# Altium project Golden_Arduino.PrjPcb
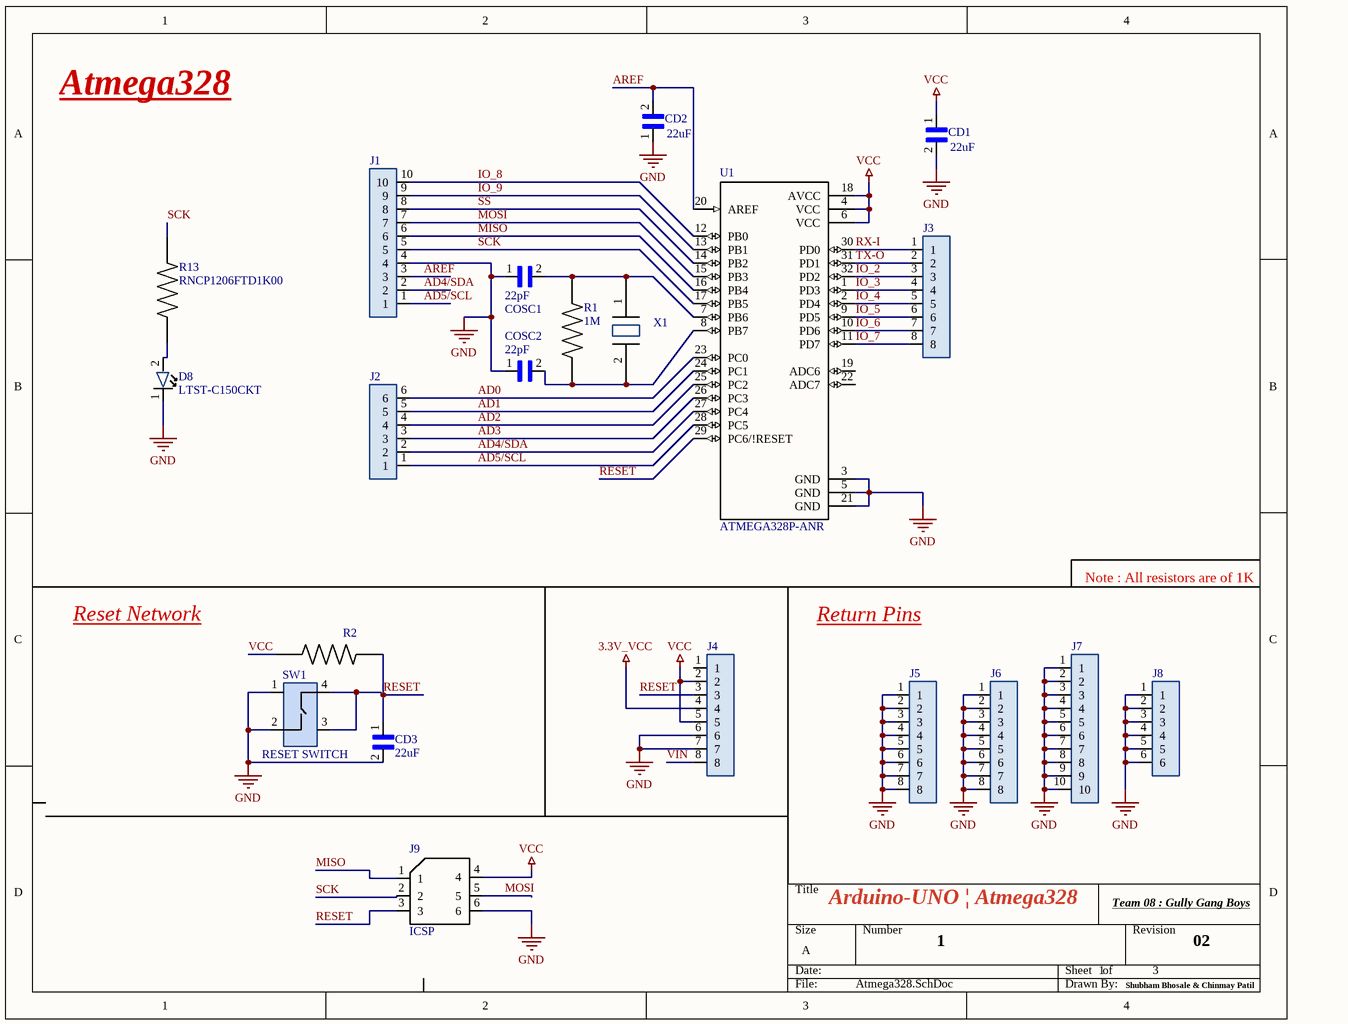
[diagram p0: Atmega328.SchDoc]
3 sheets, 52 parts. Net scope: global (net labels, ports and power ports of the same name join across sheets).
Board file: GoldenArduino.PcbDoc
Sheets:
  Atmega328.SchDoc
  PowerSupply.SchDoc
  FTDIChip.SchDoc

## Sheet Atmega328.SchDoc
size A

### Parts
CD1  22uF  [1206_Passive]
CD2  22uF  [1206_Passive]
CD3  22uF  [1206_Passive]
COSC1  22pF  [1206_Passive]
COSC2  22pF  [1206_Passive]
D8  LTST-C150CKT  [LED]
J1  PPTC101LFBN-RC  [10_PIN]  (value not drawn)
J2  PPTC061LFBN-RC  [6_PIN]  (value not drawn)
J3  PPTC081LFBN-RC  [8_PIN]  (value not drawn)
J4  PPTC081LFBN-RC  [8_PIN]  (value not drawn)
J5  PPTC081LFBN-RC  [8_PIN]  (value not drawn)
J6  PPTC081LFBN-RC  [8_PIN]  (value not drawn)
J7  PPTC101LFBN-RC  [10_PIN]  (value not drawn)
J8  PPTC061LFBN-RC  [6_PIN]  (value not drawn)
J9  ICSP  [ICSP]
R1  1M  [1206_Passive]
R2  RNCP1206FTD1K00  [1206_Passive]  (value not drawn)
R13  RNCP1206FTD1K00  [1206_Passive]
SW1  RESET SWITCH  [Switch]
U1  ATMEGA328P-ANR  [ATMega328P]
X1  ABLS-16.000MHZ-B4-T  [Crystal]  (value not drawn)

### Nets
3.3V_VCC: J4.4
GND: CD1.2 CD2.1 CD3.2 COSC1.1 COSC2.1 D8.1 J1.4 J4.6 J4.7 J5.1 J5.2 J5.3 J5.4 J5.5 J5.6 J5.7 J5.8 J6.1 J6.2 J6.3 J6.4 J6.5 J6.6 J6.7 J6.8 J7.1 J7.2 J7.3 J7.4 J7.5 J7.6 J7.7 J7.8 J7.9 J7.10 J8.1 J8.2 J8.3 J8.4 J8.5 J8.6 J9.6 SW1.1 SW1.2 U1.3(GND) U1.5(GND) U1.21(GND)
VCC: CD1.1 J4.2 J4.5 J9.4 R2.1 U1.4(VCC) U1.6(VCC) U1.18(AVCC)
AD0: J2.6 U1.23(PC0)
AD1: J2.5 U1.24(PC1)
AD2: J2.4 U1.25(PC2)
AD3: J2.3 U1.26(PC3)
AD4/SDA: J1.2 J2.2 U1.27(PC4)
AD5/SCL: J1.1 J2.1 U1.28(PC5)
AREF: CD2.2 J1.3 U1.20(AREF)
IO_2: J3.3 U1.32(PD2)
IO_3: J3.4 U1.1(PD3)
IO_4: J3.5 U1.2(PD4)
IO_5: J3.6 U1.9(PD5)
IO_6: J3.7 U1.10(PD6)
IO_7: J3.8 U1.11(PD7)
IO_8: J1.10 U1.12(PB0)
IO_9: J1.9 U1.13(PB1)
MISO: J1.6 J9.1 U1.16(PB4)
MOSI: J1.7 J9.5 U1.15(PB3)
RESET: CD3.1 J4.3 J9.3 R2.2 SW1.3 SW1.4 U1.29(PC6/!RESET)
RX-I: J3.1 U1.30(PD0)
SCK: J1.5 J9.2 R13.2 U1.17(PB5)
SS: J1.8 U1.14(PB2)
TX-O: J3.2 U1.31(PD1)
VIN: J4.8
NetCOSC1_2: COSC1.2 R1.2 U1.7(PB6) X1.1
NetCOSC2_2: COSC2.2 R1.1 U1.8(PB7) X1.2
NetD8_2: D8.2 R13.1

Not connected (* = marked no-connect by the designer): J4 1; U1 19(ADC6) 22(ADC7)

### Notes on the sheet
- Atmega328
- Reset Network
- Return Pins
- Note : All resistors are of 1K
- Arduino-UNO | Atmega328
- Team 08 : Gully Gang Boys
- 1
- 3
- 02
- Shubham Bhosale & Chinmay Patil

### Library data of the parts
CD1-CD3 = 1206_22uF: 22µF ±20% 16V Ceramic Capacitor X5R 1206 (3216 Metric); Value: CAP CER 22UF 16V X5R 1206; Digikey Link: https://www.digikey.com/product-detail/en/CL31A226MOCLNNC/1276-2728-1-ND/3890814/?itemSeq=304982363; Digikey Part: 1276-2728-1-ND
COSC1 COSC2 = 1206_22pF: 22pF ±5% 16V Ceramic Capacitor C0G, NP0 1206 (3216 Metric); Value: CAP CER 22PF 16V C0G/NP0 1206; Digikey Link: https://www.digikey.com/product-detail/en/885012008011/732-7867-1-ND/5454494/?itemSeq=304982362; Digikey Part: 732-7867-1-ND
D8 = 1206_RED_LED: Red 638nm LED Indication - Discrete 1.8V 1206 (3216 Metric); Value: LED RED CLEAR 1206 SMD; Digikey Link: https://www.digikey.com/product-detail/en/LTST-C150CKT/160-1167-1-ND/269239/?itemSeq=304982368; Digikey Part: 160-1167-1-ND
J1 J7 = 10_PIN_FEMALE: 10 Position Header Connector 0.100" (2.54mm) Through Hole Tin; Value: CONN HDR 10POS 0.1 TIN PCB; Digikey Link: https://www.digikey.com/product-detail/en/PPTC101LFBN-RC/S7008-ND/810149/?itemSeq=304982352; Digikey Part: S7008-ND
J2 J8 = 6_PIN_FEMALE: 6 Position Header Connector 0.100" (2.54mm) Through Hole Tin; Value: CONN HDR 6POS 0.1 TIN PCB; Digikey Link: https://www.digikey.com/product-detail/en/PPTC061LFBN-RC/S7004-ND/810145/?itemSeq=304982353; Digikey Part: S7004-ND
J3-J6 = 8_PIN_FEMALE: 8 Position Header Connector 0.100" (2.54mm) Through Hole Tin; Value: CONN HDR 8POS 0.1 TIN PCB; Digikey Link: https://www.digikey.com/product-detail/en/PPTC081LFBN-RC/S7006-ND/810147/?itemSeq=304982354; Digikey Part: S7006-ND
J9 = ICSP: Connector Header Through Hole 6 position 0.079" (2.00mm); Value: NRPN032PAEN-RC; Digikey Link: https://www.digikey.com/product-detail/en/NRPN032PAEN-RC/S5801-03-ND/804955/?itemSeq=304982355; Digikey Part: S5801-03-ND
R1 = 1206_1M: 1 MOhms ±5% 0.25W, 1/4W Chip Resistor 1206 (3216 Metric) Automotive AEC-Q200 Thick Film; Value: RES 1M OHM 5% 1/4W 1206; Digikey Link: https://www.digikey.com/product-detail/en/RMCF1206JT1M00/RMCF1206JT1M00CT-ND/1942830/?itemSeq=304982358; Digikey Part: Number RMCF1206JT1M00CT-ND
R2 R13 = 1206_1K: 1 kOhms ±1% 0.5W, 1/2W Chip Resistor 1206 (3216 Metric) Anti-Sulfur, Moisture Resistant Thin Film; Value: RES 1K OHM 1% 1/2W 1206; Digikey Link: https://www.digikey.com/product-detail/en/RNCP1206FTD1K00/RNCP1206FTD1K00CT-ND/2240675/?itemSeq=304982373; Digikey Part: RNCP1206FTD1K00CT-ND
SW1 = Push_Button: Tactile Switch SPST-NO Top Actuated Surface Mount; Value: SWITCH TACTILE SPST-NO 50MA 12V; Digikey Link: https://www.digikey.com/product-detail/en/TL3305AF160QG/EG5350CT-ND/5816195/?itemSeq=304982361; Digikey Part: EG5350CT-ND
U1 = ATMega328P: AVR AVR® ATmega Microcontroller IC 8-Bit 20MHz 32KB (16K x 16) FLASH 32-TQFP (7x7); Value: IC MCU 8BIT 32KB FLASH 32TQFP; Digikey Link: https://www.digikey.com/product-detail/en/ATMEGA328P-ANR/ATMEGA328P-ANRCT-ND/2774230/?itemSeq=304982365; Digikey Part: ATMEGA328P-ANRCT-ND
X1 = 16MHz_Crystal: 16MHz ±30ppm Crystal 18pF 40 Ohms HC-49/US; Value: CRYSTAL 16.0000MHZ 18PF SMD; Digikey Link: https://www.digikey.com/product-detail/en/ABLS-16.000MHZ-B4-T/535-10226-1-ND/2184261/?itemSeq=304982364; Digikey Part: 535-10226-1-ND

## Sheet PowerSupply.SchDoc
size A
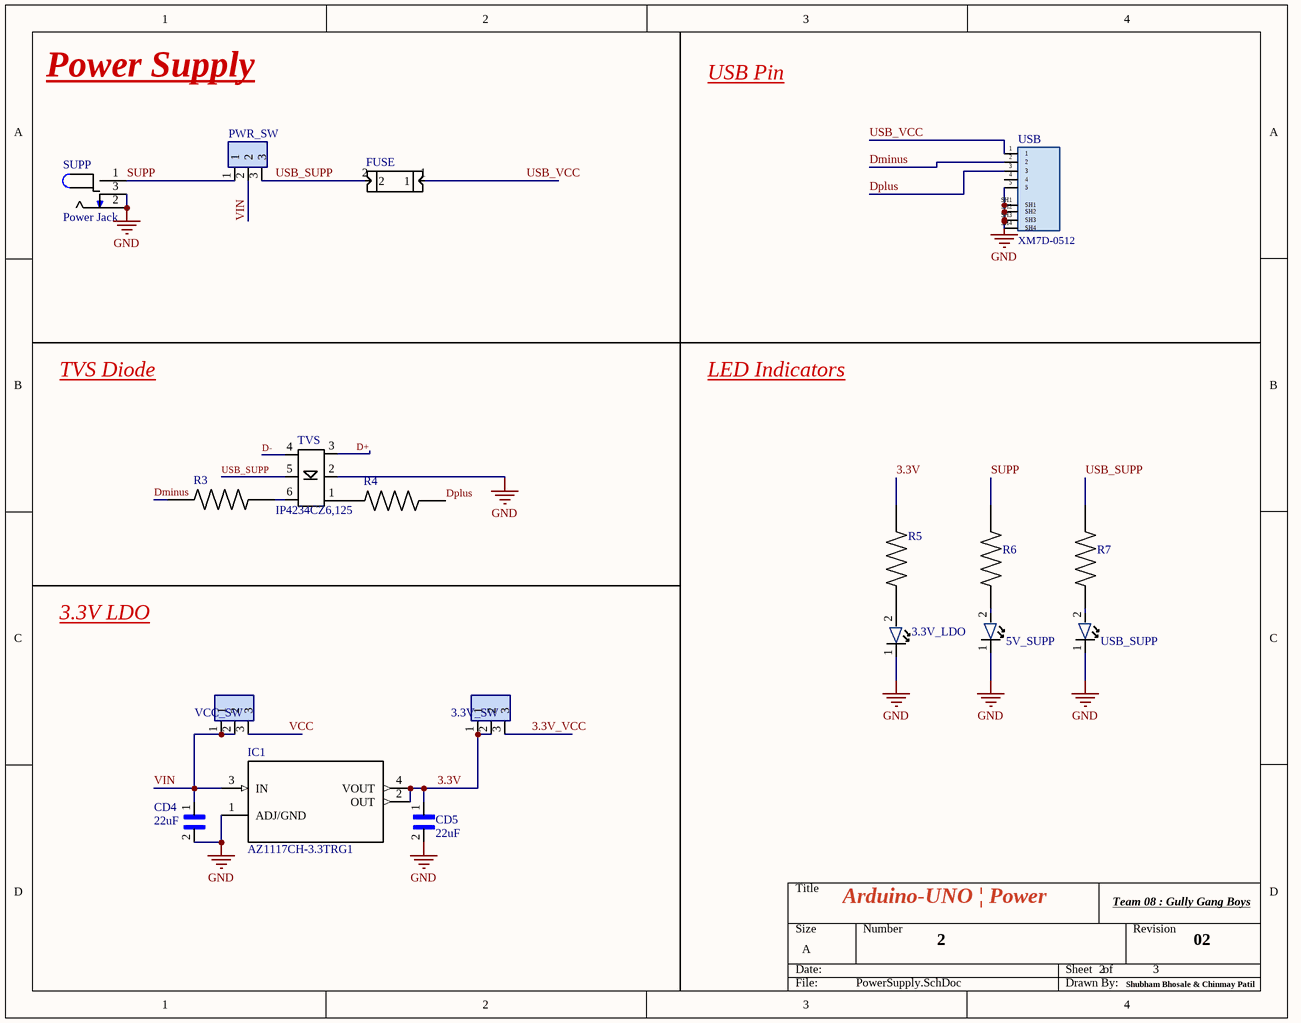
[diagram p1: PowerSupply.SchDoc]

### Parts
3.3V_LDO  LTST-C150CKT  [LED]  (value not drawn)
3.3V_SW  PREC003SAAN-RC  [3_PIN]  (value not drawn)
5V_SUPP  LTST-C150CKT  [LED]  (value not drawn)
CD4  22uF  [1206_Passive]
CD5  22uF  [1206_Passive]
FUSE  MF-MSMF050-2  [FUSE]  (value not drawn)
IC1  AZ1117CH-3.3TRG1  [LDO]
PWR_SW  PREC003SAAN-RC  [3_PIN]  (value not drawn)
R3  RMCF1206JT300R‎  [1206_Passive]  (value not drawn)
R4  RMCF1206JT300R‎  [1206_Passive]  (value not drawn)
R5  RNCP1206FTD1K00  [1206_Passive]  (value not drawn)
R6  RNCP1206FTD1K00  [1206_Passive]  (value not drawn)
R7  RNCP1206FTD1K00  [1206_Passive]  (value not drawn)
SUPP  Power Jack  [Power_Jack]
TVS  IP4234CZ6,125  [TVS]
USB  XM7D-0512  [USB]
USB_SUPP  LTST-C150CKT  [LED]  (value not drawn)
VCC_SW  PREC003SAAN-RC  [3_PIN]  (value not drawn)

### Nets
3.3V_VCC: 3.3V_SW.3
GND: 3.3V_LDO.1 5V_SUPP.1 CD4.2 CD5.2 IC1.1(ADJ/GND) SUPP.2 SUPP.3 TVS.2 USB.5 USB.SH1 USB.SH2 USB.SH3 USB.SH4 USB_SUPP.1
VCC: VCC_SW.3
3.3V: 3.3V_SW.1 3.3V_SW.2 CD5.1 IC1.2(OUT) IC1.4(VOUT) R5.2
D+: TVS.3
D-: TVS.4
Dminus: R3.1 USB.2
Dplus: R4.2 USB.3
SUPP: PWR_SW.1 R6.1 SUPP.1
USB_SUPP: FUSE.2 PWR_SW.3 R7.1 TVS.5
USB_VCC: FUSE.1 USB.1
VIN: CD4.1 IC1.3(IN) PWR_SW.2 VCC_SW.1 VCC_SW.2
Net3.3V_LDO_2: 3.3V_LDO.2 R5.1
Net5V_SUPP_2: 5V_SUPP.2 R6.2
NetR3_2: R3.2 TVS.6
NetR4_1: R4.1 TVS.1
NetR7_2: R7.2 USB_SUPP.2

Not connected (* = marked no-connect by the designer): USB 4

### Notes on the sheet
- Power Supply
- USB Pin
- TVS Diode
- LED Indicators
- 3.3V LDO
- Arduino-UNO | Power
- Team 08 : Gully Gang Boys
- 2
- 3
- 02
- Shubham Bhosale & Chinmay Patil

### Library data of the parts
3.3V_LDO 5V_SUPP USB_SUPP = 1206_RED_LED: as D8 on sheet Atmega328; Digikey Link: https://www.digikey.com/product-detail/en/LTST-C150CKT/160-1167-1-ND/269239/?itemSeq=304982368; Digikey Part: 160-1167-1-ND
3.3V_SW PWR_SW VCC_SW = 3_PIN: Connector Header Through Hole 3 position 0.100" (2.54mm); Value: CONN HEADER VERT 3POS 2.54MM; Digikey Link: https://www.digikey.com/product-detail/en/PREC003SAAN-RC/S1012EC-03-ND/2774851/?itemSeq=304982371; Digikey Part: S1012EC-03-ND
CD4 CD5 = 1206_22uF: as CD1 on sheet Atmega328; Digikey Link: https://www.digikey.com/product-detail/en/CL31A226MOCLNNC/1276-2728-1-ND/3890814/?itemSeq=304982363; Digikey Part: 1276-2728-1-ND
FUSE = Fuse: Polymeric PTC Resettable Fuse 15V 500mA Ih Surface Mount 1812 (4532 Metric), Concave; Value: PTC RESET FUSE 15V 500MA 1812; Digikey Link: https://www.digikey.com/product-detail/en/MF-MSMF050-2/MF-MSMF050-2CT-ND/662842/?itemSeq=304982360; Digikey Part: MF-MSMF050-2CT-ND
IC1 = 3.3V_LDO: Linear Voltage Regulator IC Positive Fixed 1 Output 1A SOT-223; Value: IC REG LINEAR 3.3V 800MA SOT223; Digikey Link: https://www.digikey.com/product-detail/en/AZ1117CH-3.3TRG1/AZ1117CH-3.3TRG1DICT-ND/4505206/?itemSeq=304982370; Digikey Part: AZ1117CH-3.3TRG1DICT-ND
R3 R4 = 1206_300Ohm: 300 Ohms ±5% 0.25W, 1/4W Chip Resistor 1206 (3216 Metric) Automotive AEC-Q200 Thick Film; Value: 300Ohm; Digikey Link: https://www.digikey.com/product-detail/en/RMCF1206JT300R/RMCF1206JT300RCT-ND/1942776/?itemSeq=304982374; Digikey Part: RMCF1206JT300RCT-ND
R5-R7 = 1206_1K: as R2 on sheet Atmega328; Digikey Link: https://www.digikey.com/product-detail/en/RNCP1206FTD1K00/RNCP1206FTD1K00CT-ND/2240675/?itemSeq=304982373; Digikey Part: RNCP1206FTD1K00CT-ND
SUPP = Power Jack: Power Barrel Connector Jack 2.10mm ID (0.083"), 5.50mm OD (0.217") Through Hole, Right Angle; Value: CONN PWR JACK 2X5.5MM SOLDER; Digikey Link: https://www.digikey.com/product-detail/en/PJ-102A/CP-102A-ND/275425/?itemSeq=304982367; Digikey Part: CP-102A-ND
TVS = TVS_Diode: Clamp Ipp Tvs Diode Surface Mount 6-TSOP; Value: TVS DIODE 5.5V 6TSOP; Digikey Part: 1727-4717-1-ND; Digikey Link: https://www.digikey.com/product-detail/en/IP4234CZ6%2c125/1727-4717-1-ND/2531156/?itemSeq=304982369
USB = USB: USB - mini B USB 2.0 Receptacle Connector 5 Position Through Hole, Right Angle; Value: CONN RCPT USB2.0 MINI B 5P R/A; Digikey Link: https://www.digikey.com/product-detail/en/XM7D-0512/OR1205-ND/4695531/?itemSeq=304982356; Digikey Part: OR1205-ND

## Sheet FTDIChip.SchDoc
size A
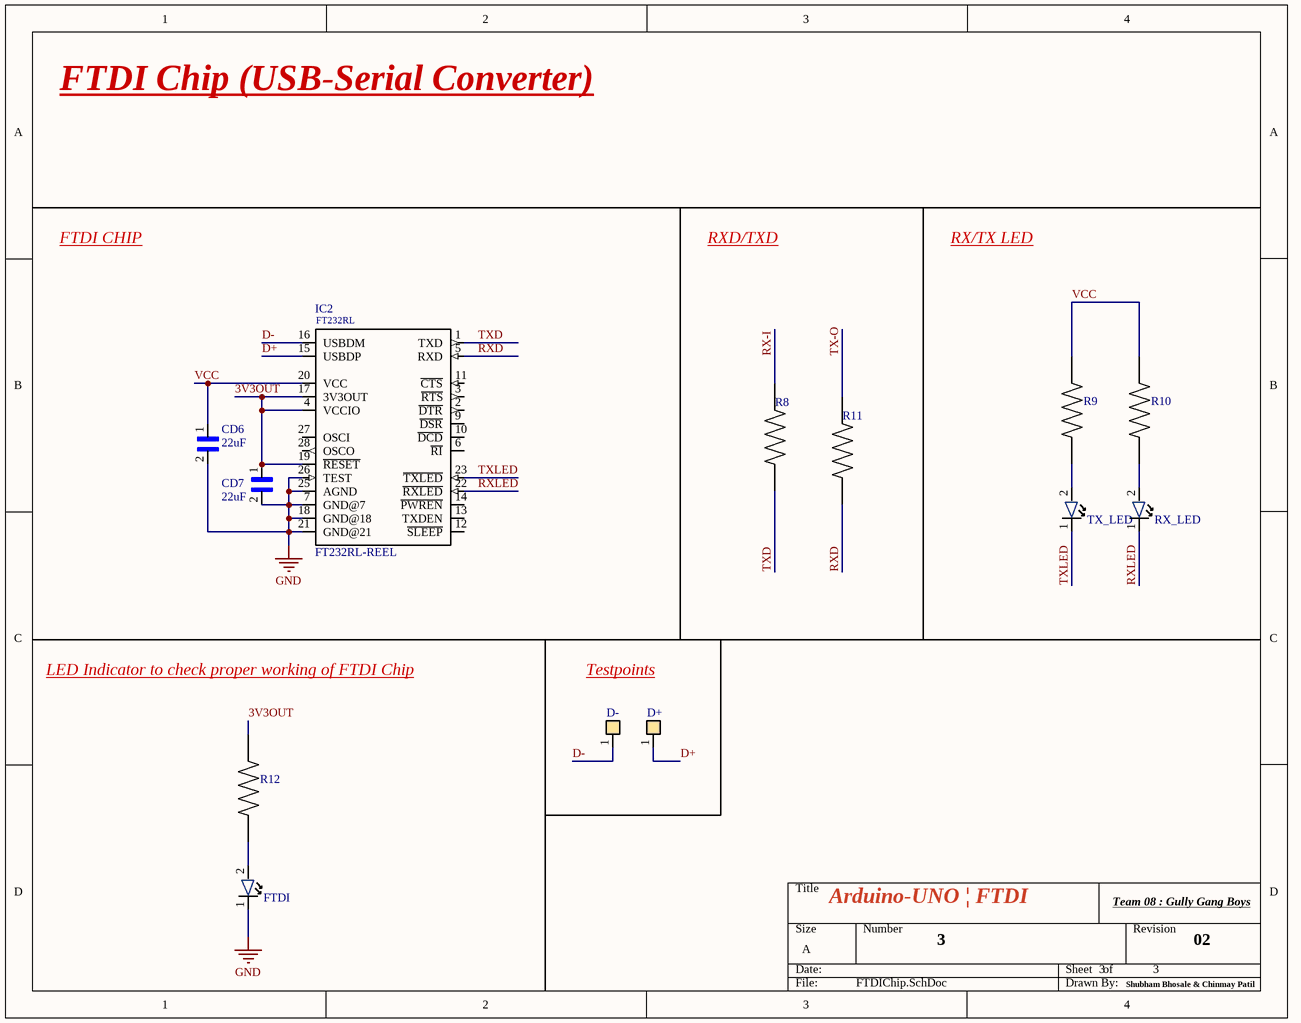
[diagram p2: FTDIChip.SchDoc]

### Parts
CD6  22uF  [1206_Passive]
CD7  22uF  [1206_Passive]
D+  TESTPOINT  [TEST POINT]  (value not drawn)
D-  TESTPOINT  [TEST POINT]  (value not drawn)
FTDI  LTST-C150CKT  [LED]  (value not drawn)
IC2  FT232RL-REEL  [FTDI]
R8  RNCP1206FTD1K00  [1206_Passive]  (value not drawn)
R9  RNCP1206FTD1K00  [1206_Passive]  (value not drawn)
R10  RNCP1206FTD1K00  [1206_Passive]  (value not drawn)
R11  RNCP1206FTD1K00  [1206_Passive]  (value not drawn)
R12  RNCP1206FTD1K00  [1206_Passive]  (value not drawn)
RX_LED  LTST-C150CKT  [LED]  (value not drawn)
TX_LED  LTST-C150CKT  [LED]  (value not drawn)

### Nets
GND: CD6.2 CD7.2 FTDI.1 IC2.7(GND@7) IC2.18(GND@18) IC2.21(GND@21) IC2.25(AGND) IC2.26(TEST)
VCC: CD6.1 IC2.20(VCC) R9.1 R10.1
3V3OUT: CD7.1 IC2.4(VCCIO) IC2.17(3V3OUT) IC2.19(~{RESET}) R12.1
D+: D+.1 IC2.15(USBDP)
D-: D-.1 IC2.16(USBDM)
RX-I: R8.2
RXD: IC2.5(RXD) R11.1
RXLED: IC2.22(~{RXLED}) RX_LED.1
TX-O: R11.2
TXD: IC2.1(TXD) R8.1
TXLED: IC2.23(~{TXLED}) TX_LED.1
NetFTDI_2: FTDI.2 R12.2
NetR9_2: R9.2 TX_LED.2
NetR10_2: R10.2 RX_LED.2

Not connected (* = marked no-connect by the designer): IC2 2(~{DTR}) 3(~{RTS}) 6(~{RI}) 9(~{DSR}) 10(~{DCD}) 11(~{CTS}) 12(~{SLEEP}) 13(TXDEN) 14(~{PWREN}) 27(OSCI) 28(OSCO)

### Notes on the sheet
- FTDI Chip (USB-Serial Converter)
- FTDI CHIP
- RXD/TXD
- RX/TX LED
- LED Indicator to check proper working of FTDI Chip
- Testpoints
- Arduino-UNO | FTDI
- Team 08 : Gully Gang Boys
- 3
- 02
- Shubham Bhosale & Chinmay Patil
- (in symbol FTDI) FT232RL

### Library data of the parts
CD6 CD7 = 1206_22uF: as CD1 on sheet Atmega328; Digikey Link: https://www.digikey.com/product-detail/en/CL31A226MOCLNNC/1276-2728-1-ND/3890814/?itemSeq=304982363; Digikey Part: 1276-2728-1-ND
D+ D- = TEST POINT
FTDI RX_LED TX_LED = 1206_RED_LED: as D8 on sheet Atmega328; Digikey Link: https://www.digikey.com/product-detail/en/LTST-C150CKT/160-1167-1-ND/269239/?itemSeq=304982368; Digikey Part: 160-1167-1-ND
IC2 = FTDI: USB Bridge, USB to UART USB 2.0 UART Interface 28-SSOP; Value: IC USB FS SERIAL UART 28-SSOP; Digikey Part: 768-1007-1-ND; Digikey Link: https://www.digikey.com/product-detail/en/FT232RL-REEL/768-1007-1-ND/1836402/?itemSeq=304982359
R8-R12 = 1206_1K: as R2 on sheet Atmega328; Digikey Link: https://www.digikey.com/product-detail/en/RNCP1206FTD1K00/RNCP1206FTD1K00CT-ND/2240675/?itemSeq=304982373; Digikey Part: RNCP1206FTD1K00CT-ND

## Nets that join several sheets
3.3V_VCC: Atmega328 (J4.4), PowerSupply (3.3V_SW.3)
GND: Atmega328 (47 pins), PowerSupply (14 pins), FTDIChip (8 pins)
VCC: Atmega328 (8 pins), PowerSupply (VCC_SW.3), FTDIChip (CD6.1 IC2.20 R9.1 R10.1)
D+: PowerSupply (TVS.3), FTDIChip (D+.1 IC2.15)
D-: PowerSupply (TVS.4), FTDIChip (D-.1 IC2.16)
RX-I: Atmega328 (J3.1 U1.30), FTDIChip (R8.2)
TX-O: Atmega328 (J3.2 U1.31), FTDIChip (R11.2)
VIN: Atmega328 (J4.8), PowerSupply (5 pins)